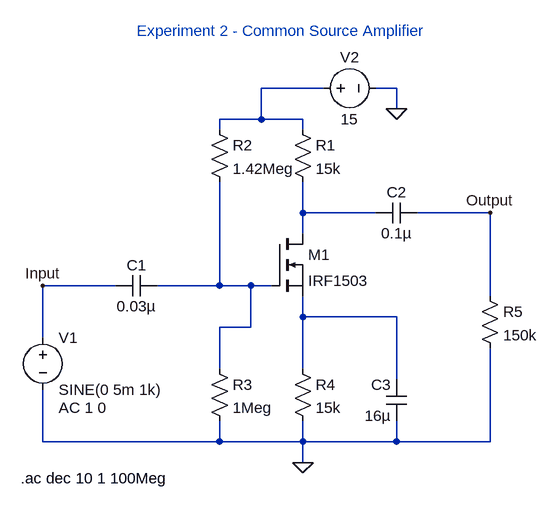
[diagram p0: schematic Experiment 2 - Common Source Amplifier.asc]
Experiment 2 - Common Source Amplifier.asc, the LTspice schematic file:
Version 4
SHEET 1 1292 680
WIRE 272 48 176 48
WIRE 384 48 352 48
WIRE 384 80 384 48
WIRE 176 96 176 48
WIRE 176 96 112 96
WIRE 240 96 176 96
WIRE 112 112 112 96
WIRE 240 112 240 96
WIRE 240 240 240 192
WIRE 352 240 240 240
WIRE 528 240 416 240
WIRE 240 272 240 240
WIRE -48 352 -160 352
WIRE 112 352 112 192
WIRE 112 352 16 352
WIRE 160 352 112 352
WIRE 192 352 160 352
WIRE 528 368 528 240
WIRE 240 400 240 368
WIRE 384 400 240 400
WIRE 160 416 160 352
WIRE 160 416 112 416
WIRE -160 432 -160 352
WIRE 112 480 112 416
WIRE 240 480 240 400
WIRE 384 496 384 400
WIRE -160 592 -160 512
WIRE 112 592 112 560
WIRE 112 592 -160 592
WIRE 240 592 240 560
WIRE 240 592 112 592
WIRE 384 592 384 560
WIRE 384 592 240 592
WIRE 528 592 528 448
WIRE 528 592 384 592
WIRE 240 624 240 592
FLAG 384 80 0
FLAG 240 624 0
FLAG 528 240 Output
FLAG -160 352 Input
SYMBOL nmos 192 272 R0
SYMATTR InstName M1
SYMATTR Value IRF1503
SYMBOL voltage -160 416 R0
WINDOW 123 24 124 Left 2
WINDOW 39 0 0 Left 0
SYMATTR InstName V1
SYMATTR Value SINE(0 5m 1k)
SYMATTR Value2 AC 1 0
SYMBOL cap 16 336 R90
WINDOW 0 0 32 VBottom 2
WINDOW 3 32 32 VTop 2
SYMATTR InstName C1
SYMATTR Value 0.03µ
SYMBOL res 96 464 R0
SYMATTR InstName R3
SYMATTR Value 1Meg
SYMBOL res 224 464 R0
SYMATTR InstName R4
SYMATTR Value 15k
SYMBOL res 96 96 R0
SYMATTR InstName R2
SYMATTR Value 1.42Meg
SYMBOL res 224 96 R0
SYMATTR InstName R1
SYMATTR Value 15k
SYMBOL voltage 256 48 R270
WINDOW 0 32 56 VTop 2
WINDOW 3 -32 56 VBottom 2
WINDOW 123 0 0 Left 0
WINDOW 39 0 0 Left 0
SYMATTR InstName V2
SYMATTR Value 15
SYMBOL cap 416 224 R90
WINDOW 0 0 32 VBottom 2
WINDOW 3 32 32 VTop 2
SYMATTR InstName C2
SYMATTR Value 0.1µ
SYMBOL cap 400 560 R180
WINDOW 0 24 56 Left 2
WINDOW 3 24 8 Left 2
SYMATTR InstName C3
SYMATTR Value 16µ
SYMBOL res 512 352 R0
SYMATTR InstName R5
SYMATTR Value 150k
TEXT -16 -40 Left 2 ;Experiment 2 - Common Source Amplifier
TEXT -194 648 Left 2 !.ac dec 10 1 100Meg

The netlist it stands for:
* Experiment 2 - Common Source Amplifier.asc
M1 N002 N003 N004 N004 IRF1503
V1 Input 0 SINE(0 5m 1k) AC 1 0
C1 N003 Input 0.03µ
R3 N003 0 1Meg
R4 N004 0 15k
R2 N001 N003 1.42Meg
R1 N001 N002 15k
V2 N001 0 15
C2 Output N002 0.1µ
C3 0 N004 16µ
R5 Output 0 150k
.model NMOS NMOS
.model PMOS PMOS
.lib standard.mos
* Experiment 2 - Common Source Amplifier
.ac dec 10 1 100Meg
.backanno
.end

* Results of the author's LTspice run, read from the files saved beside the schematic
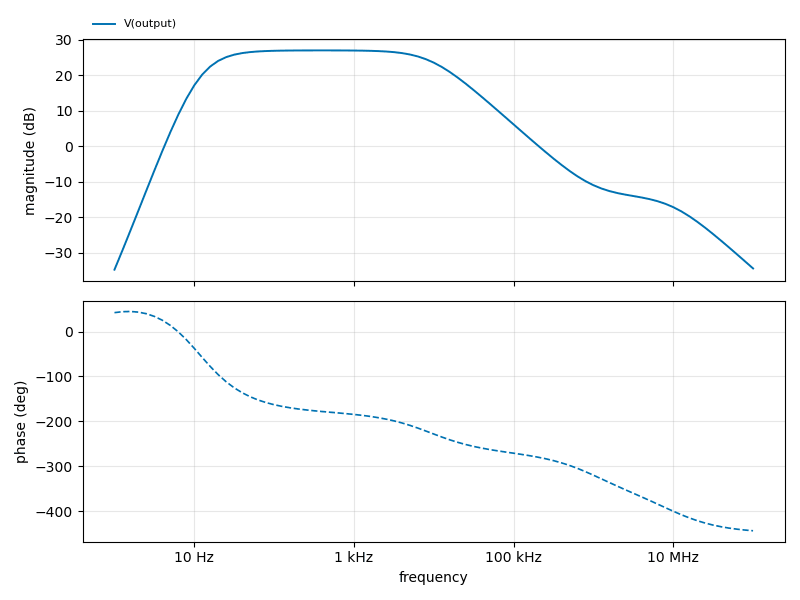
[diagram p1: AC Analysis of Experiment 2 - Common Source Amplifier.asc, plotted from the saved traces]
* AC Analysis, 1 run:
*   V(output): -34.73 dB at 1 Hz, -34.38 dB at 100 MHz, peak 26.98 dB at 398.1 Hz, 3 dB below the peak at 19.77 Hz and 9.039 kHz